# EAGLE design rs485 (EAGLE 9.6.2)
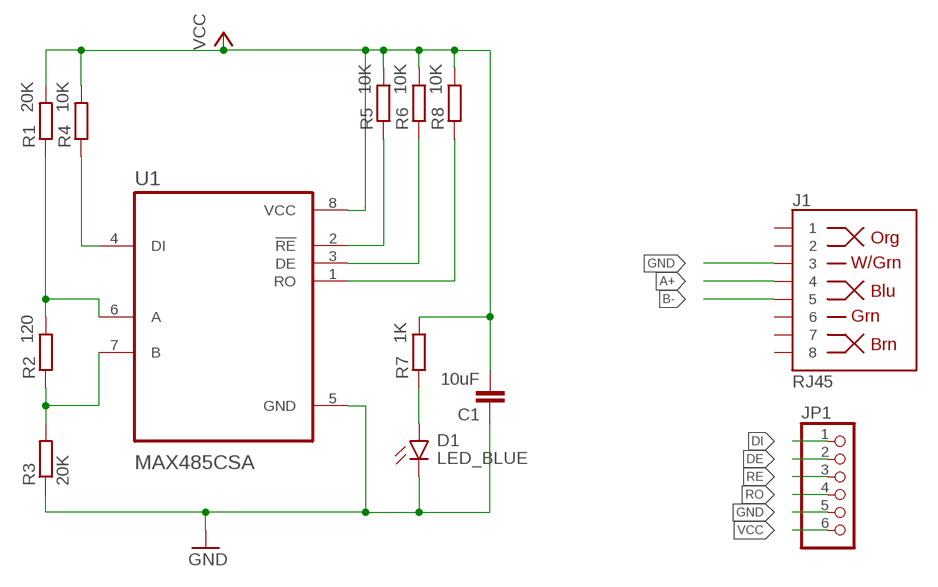
[diagram p0: schematic, sheet 1]

## Parts
C1  10uF  C-EUC1206  [C1206]
D1  LED_BLUE  CHIP-FLAT-B_1206  [LEDC3216X75N_FLAT-B]
J1  RJ45  RJ45-8  [RJ45-8]
JP1  PINHD-1X6  [1X06]
R1  20K  R-EU_M1406  [M1406]
R2  120  R-EU_M1406  [M1406]
R3  20K  R-EU_M1406  [M1406]
R4  10K  R-EU_M1406  [M1406]
R5  10K  R-EU_M1406  [M1406]
R6  10K  R-EU_M1406  [M1406]
R7  1K  R-EU_M1406  [M1406]
R8  10K  R-EU_M1406  [M1406]
U1  MAX485CSA  [SOIC127P600X175-8N]

## Nets
A+: J1.4 R1.1 R2.2 U1.6(A)
B-: J1.5 R2.1 R3.2 U1.7(B)
DE: JP1.2 R6.1 U1.3(DE)
DI: JP1.1 R4.1 U1.4(DI)
GND: C1.1 D1.C J1.3 JP1.5 R3.1 U1.5(GND)
N$1: D1.A R7.1
RE: JP1.3 R5.1 U1.2(!RE)
RO: JP1.4 R8.1 U1.1(RO)
VCC: C1.2 JP1.6 R1.2 R4.2 R5.2 R6.2 R7.2 R8.2 U1.8(VCC)
Unconnected: J1.1 J1.2 J1.6 J1.7 J1.8

## Library data of the parts
C1 = rcl:C-EU: CAPACITOR, European symbol; SPICEPREFIX: C
D1 = LED:CHIP-FLAT-B; CATEGORY: LED; COLOR: BLUE; DESCRIPTION: CHIP LED FLAT; SUB-CATEGORY: CHIP; TYPE: FLAT_TOP
J1 = SparkFun-Connectors:RJ45-8: RJ45 Jack - 8 pin Simple RJ45, 8-pin connection. Commonly used for Cat5, Cat5e, and Cat6 Ethernet cables. Here is the connector we sell at SparkFun: RJ45 8-Pin Connector <https://www.sparkfun.com/products/643> (PRT-00643) Datasheet <https://cdn.sparkfun.com/datasheets/Prototyping/04908.pdf> It is used on this SparkFun product: SparkFun RJ45 Breakout <https://www.sparkfun.com/products/716> (BOB-00716) Note, you may also be interested in the "MAGJACK" version of this. It is basically a RJ45 connector, but also has some status LEDs built into the connector housing. You can check that out in this library at the device named "MAGJACK.dev" and see these products online: RJ45 Ethernet MagJack-Compatible <https://www.sparkfun.com/products/8534> (PRT-08534) SparkFun RJ45 MagJack Breakout <https://www.sparkfun.com/products/13021> (BOB-13021); PROD_ID: CONN-08506; SF_ID: PRT-00643
JP1 = pinhead:PINHD-1X6: PIN HEADER
R1-R8 = rcl:R-EU_: RESISTOR, European symbol; SPICEPREFIX: R
U1 = MAX485CSA:MAX485CSA; DESCRIPTION: 1/1 Transceiver Half RS422, RS485 8-SOIC; DIGI-KEY_PART_NUMBER: MAX485CSA-ND; MF: Maxim Integrated; MP: MAX485CSA; PACKAGE: SOIC-8 Maxim; PURCHASE-URL: https://pricing.snapeda.com/search/part/MAX485CSA/?ref=eda

## Board
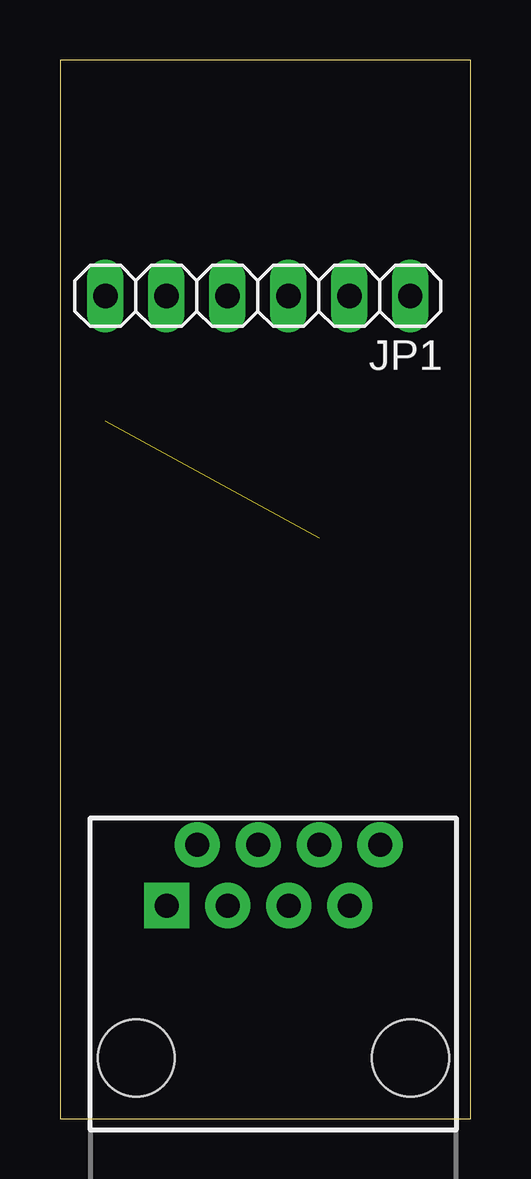
[diagram p1: board, top side]
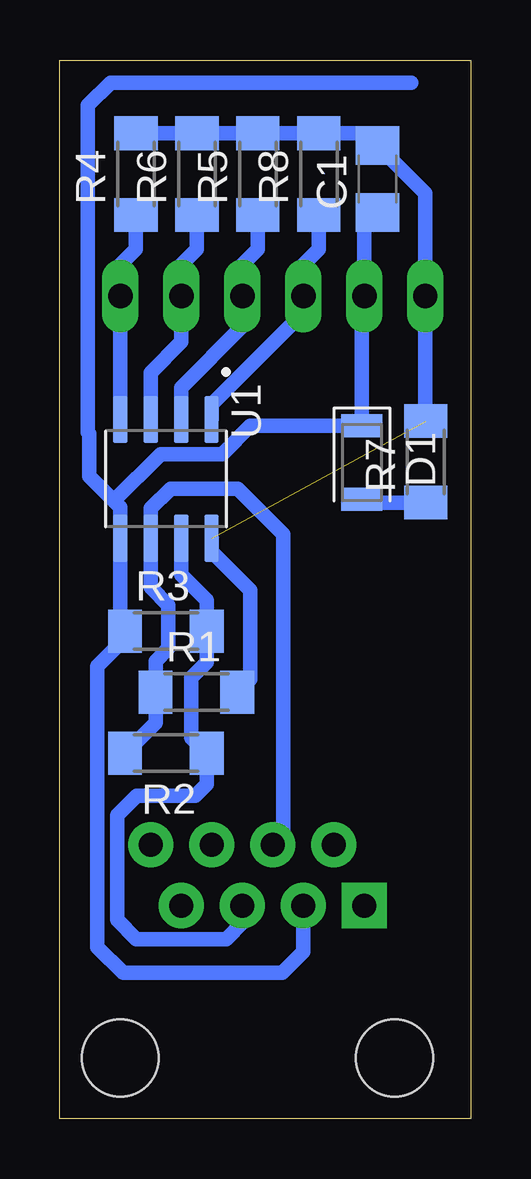
[diagram p2: board, bottom side, seen from below]

Size 17.12 x 44.12 mm. Coordinates in mm from the lower left corner, seen from the top.
Outline: 0,0 17.12,0 17.12,44.12 0,44.12 0,0
Copper layers (1*16): Top 0.035mm / dielectric 1.5mm / Bottom 0.035mm
Design rules "default": minimum track width 6mil, minimum drill 0.35mm, track to track 6mil, track to pad 6mil, pad to pad 6mil, via to via 6mil, smd to smd 6mil, copper to edge 40mil, drill to drill 6mil, minimum pad ring 10mil, minimum via ring 8mil, stop-mask expansion 4mil, vias tented up to drill 0mil, thermal gap 10mil

### Footprints (pad centres in the part's own frame; a part is rotated, then mirrored left to right if it is on the bottom)
C1206 = smd 1.6 x 1.8: 1 -1.4,0; 2 1.4,0
LEDC3216X75N_FLAT-B = smd 0.962 x 1.712: A 1.525,0; C -1.525,0
RJ45-8 = drill 1 pad 1.88 square: 1 -4.445,6.35 | drill 1 pad 1.88: 2 -3.175,8.89; 3 -1.905,6.35; 4 -0.635,8.89; 5 0.635,6.35; 6 1.905,8.89; 7 3.175,6.35; 8 4.445,8.89 | hole 3.2: -5.715,0; 5.715,0
1X06 = drill 1.016 long: 1 -6.35,0; 2 -3.81,0; 3 -1.27,0; 4 1.27,0; 5 3.81,0; 6 6.35,0
M1406 = smd 1.4 x 1.8: 1 -1.7,0; 2 1.7,0
SOIC127P600X175-8N = smd 1.97 x 0.59: 1 -2.475,1.905; 2 -2.475,0.635; 3 -2.475,-0.635; 4 -2.475,-1.905; 5 2.475,-1.905; 6 2.475,-0.635; 7 2.475,0.635; 8 2.475,1.905

### Placement (x,y rotation side)
C1  3.89,39.16 90 bottom
D1  4.54,27.35 270 bottom
J1  8.89,2.54 0 top
JP1  8.24,34.29 180 top
R1  11.43,17.78 0 bottom
R2  12.7,15.24 180 bottom
R3  12.7,20.32 0 bottom
R4  13.95,39.37 90 bottom
R5  8.87,39.37 90 bottom
R6  11.41,39.37 90 bottom
R7  1.88,27.38 90 bottom
R8  6.33,39.37 90 bottom
U1  12.7,26.67 270 bottom

### Tracks (layer width: path | path; a pad name or v marks a point on that pad's centre or on a via)
A+
  Bottom 0.61: R2.2 13.13,16.51 R1.1 13.13,19.07 12.6,19.6 12.6,21.41 13.33,22.15 U1.6 13.33,25.43 12.51,26.26 9.71,26.26 7.81,24.36 7.81,11.87 J1.4
B-
  Bottom 0.61: U1.7 12.06,22.68 11,21.61 R3.2 11,19.03 11.64,18.39 11.64,15.88 R2.1 11,13.95 11.48,13.47 13.91,13.47 14.73,12.65 14.73,8.29 13.93,7.49 10.2,7.49 9.53,8.16 J1.5
DE
  Bottom 0.61: U1.3 13.33,31.09 12.05,32.38 JP1.2 12.05,35.58 11.41,36.23 R6.1
DI
  Bottom 0.61: U1.4 14.61,34.28 JP1.1 14.59,35.58 13.95,36.23 R4.1
GND
  Bottom 0.61: 14.61,20.52 U1.5 14.61,25.48 14.87,25.75 | 14.61,20.52 R3.1 | 14.61,20.52 14.61,19.82 15.56,18.87 15.56,7.16 14.49,6.09 7.85,6.09 6.98,6.96 J1.3 | 14.87,25.75 15.89,26.77 15.89,28.55 15.95,28.61 15.95,42.23 15,43.18 2.48,43.18 | C1.1 4.44,37.22 JP1.5 4.54,34.19 D1.C 9.18,28.88 10.35,27.7 12.91,27.7 14.87,25.75
N$1
  Bottom 0.61: R7.1 4.38,25.68 D1.A
RE
  Bottom 0.61: U1.2 12.06,30.47 9.51,33.02 JP1.3 9.51,35.58 8.87,36.23 R5.1
RO
  Bottom 0.61: U1.1 10.79,29.77 6.97,33.59 JP1.4 6.97,35.58 6.33,36.23 R8.1
VCC  (1 unrouted)
  Bottom 0.61: R4.2 R6.2 R5.2 R8.2 | U1.8 10.79,23.63 9.2,22.03 9.2,18.31 R1.2 | 6.33,40.65 R8.2 | R8.2 4.4,41.07 C1.2 1.9,38.56 JP1.6 1.9,29.09 R7.2